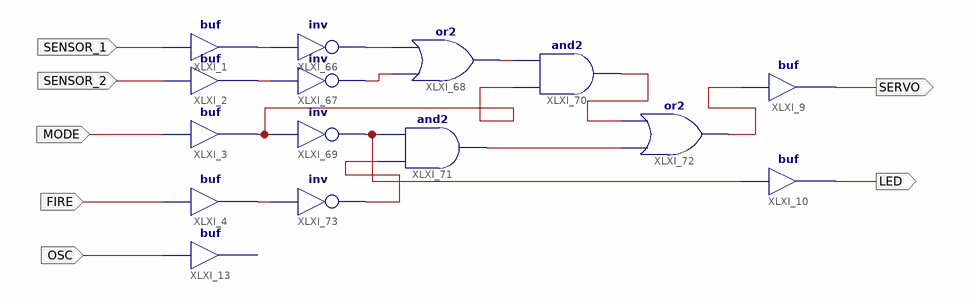
[diagram p0: schematic sheet 1]
// Xilinx ISE schematic bug_trap_controller.sch (zynq) as structural Verilog: 15 symbols, 7 ports
module bug_trap_controller (
  input  SENSOR_1,
  input  SENSOR_2,
  input  MODE,
  input  FIRE,
  input  OSC,
  output LED,
  output SERVO
);

  wire XLXN_315, XLXN_316, XLXN_317, XLXN_318, XLXN_326, XLXN_327, XLXN_335, XLXN_336, XLXN_337, XLXN_338,
       XLXN_339, XLXN_340;

  buf XLXI_1 (XLXN_315, SENSOR_1);
  buf XLXI_2 (XLXN_316, SENSOR_2);
  buf XLXI_3 (XLXN_327, MODE);
  buf XLXI_4 (XLXN_339, FIRE);
  // buf XLXI_13 has open pins: I=OSC, O=open
  buf XLXI_10 (LED, XLXN_338);
  buf XLXI_9 (SERVO, XLXN_337);
  not XLXI_66 (XLXN_317, XLXN_315);
  not XLXI_67 (XLXN_318, XLXN_316);
  or XLXI_68 (XLXN_326, XLXN_318, XLXN_317);
  not XLXI_69 (XLXN_338, XLXN_327);
  and XLXI_70 (XLXN_335, XLXN_327, XLXN_326);
  and XLXI_71 (XLXN_336, XLXN_340, XLXN_338);
  or XLXI_72 (XLXN_337, XLXN_336, XLXN_335);
  not XLXI_73 (XLXN_340, XLXN_339);
endmodule
